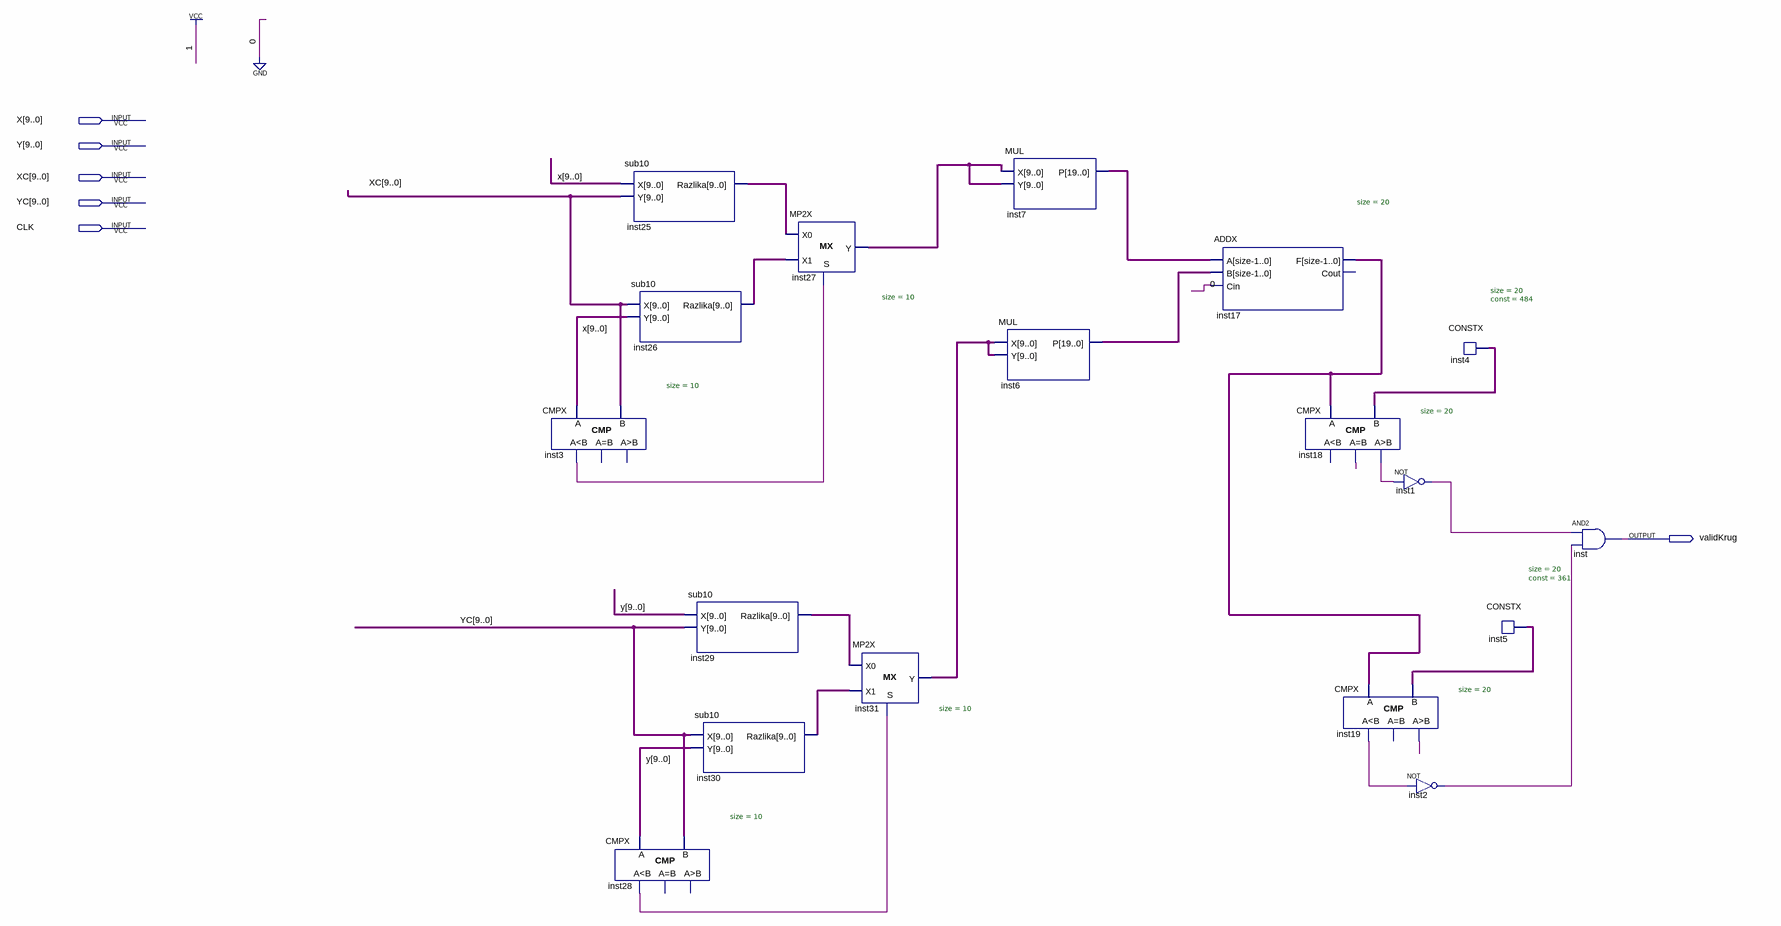
[diagram p0: schematic sheet]
// Quartus schematic krugProvera.bdf as structural Verilog: 18 symbols, 6 pins
module krugProvera (
  input  [9:0] X,
  input  [9:0] Y,
  input  [9:0] XC,
  input  [9:0] YC,
  input  CLK,
  output validKrug
);

  wire inst1_out, inst2_out, inst3_ls, inst18_eq, inst18_gr, inst19_gr, inst19_ls, inst28_ls;
  wire [9:0] inst25_razlika, inst26_razlika, inst27_y, inst29_razlika, inst30_razlika, inst31_y;
  wire [19:0] inst4_data, inst5_data, inst6_p, inst7_p, inst17_f;

  CMPX #(.size(10)) inst3 (.A(X), .B(XC), .ls(inst3_ls));  // open: eq, gr
  CMPX #(.size(10)) inst28 (.A(Y), .B(YC), .ls(inst28_ls));  // open: eq, gr
  sub10 inst25 (.X(X), .Y(XC), .Razlika(inst25_razlika));
  sub10 inst26 (.X(XC), .Y(X), .Razlika(inst26_razlika));
  sub10 inst29 (.X(Y), .Y(YC), .Razlika(inst29_razlika));
  sub10 inst30 (.X(YC), .Y(Y), .Razlika(inst30_razlika));
  MP2X #(.size(10)) inst27 (.S(inst3_ls), .X0(inst25_razlika), .X1(inst26_razlika), .Y(inst27_y));
  MP2X #(.size(10)) inst31 (.S(inst28_ls), .X0(inst29_razlika), .X1(inst30_razlika), .Y(inst31_y));
  MUL inst7 (.X(inst27_y), .Y(inst27_y), .P(inst7_p));
  MUL inst6 (.X(inst31_y), .Y(inst31_y), .P(inst6_p));
  ADDX #(.size(20)) inst17 (.A(inst7_p), .B(inst6_p), .Cin(1'b0), .F(inst17_f));  // open: Cout
  CMPX #(.size(20)) inst18 (.A(inst17_f), .B(inst4_data), .eq(inst18_eq), .gr(inst18_gr));  // open: ls
  CMPX #(.size(20)) inst19 (.A(inst17_f), .B(inst5_data), .ls(inst19_ls), .gr(inst19_gr));  // open: eq
  not inst1 (inst1_out, inst18_gr);
  not inst2 (inst2_out, inst19_ls);
  CONSTX #(.size(20), .\const (484)) inst4 (.data(inst4_data));
  CONSTX #(.size(20), .\const (361)) inst5 (.data(inst5_data));
  and inst (validKrug, inst1_out, inst2_out);
endmodule
